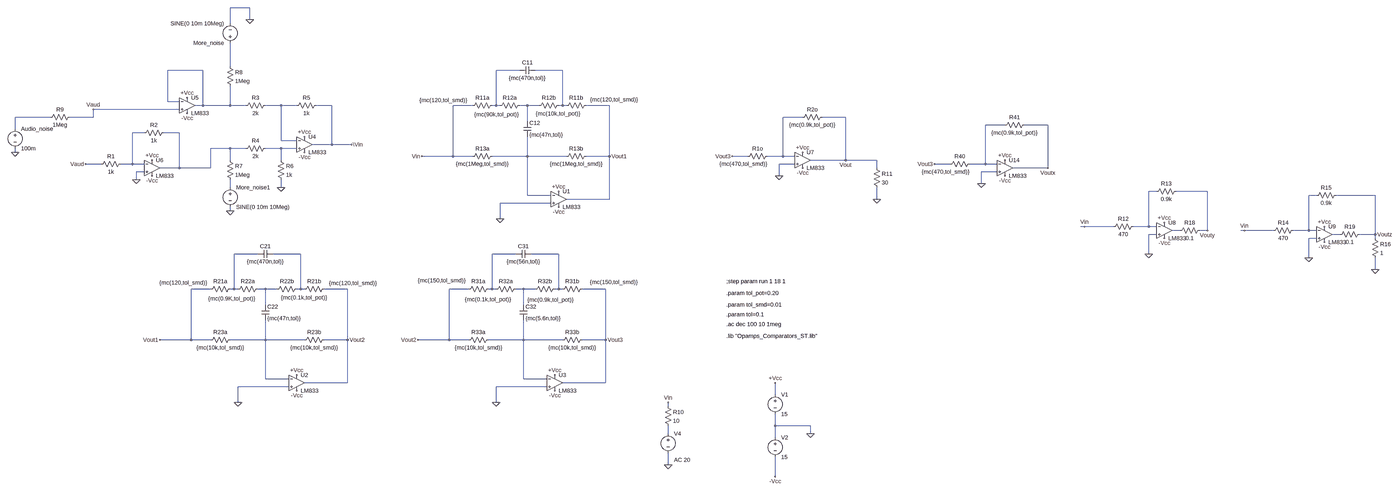
[diagram p0: schematic 3 band EQ.asc, whole sheet]
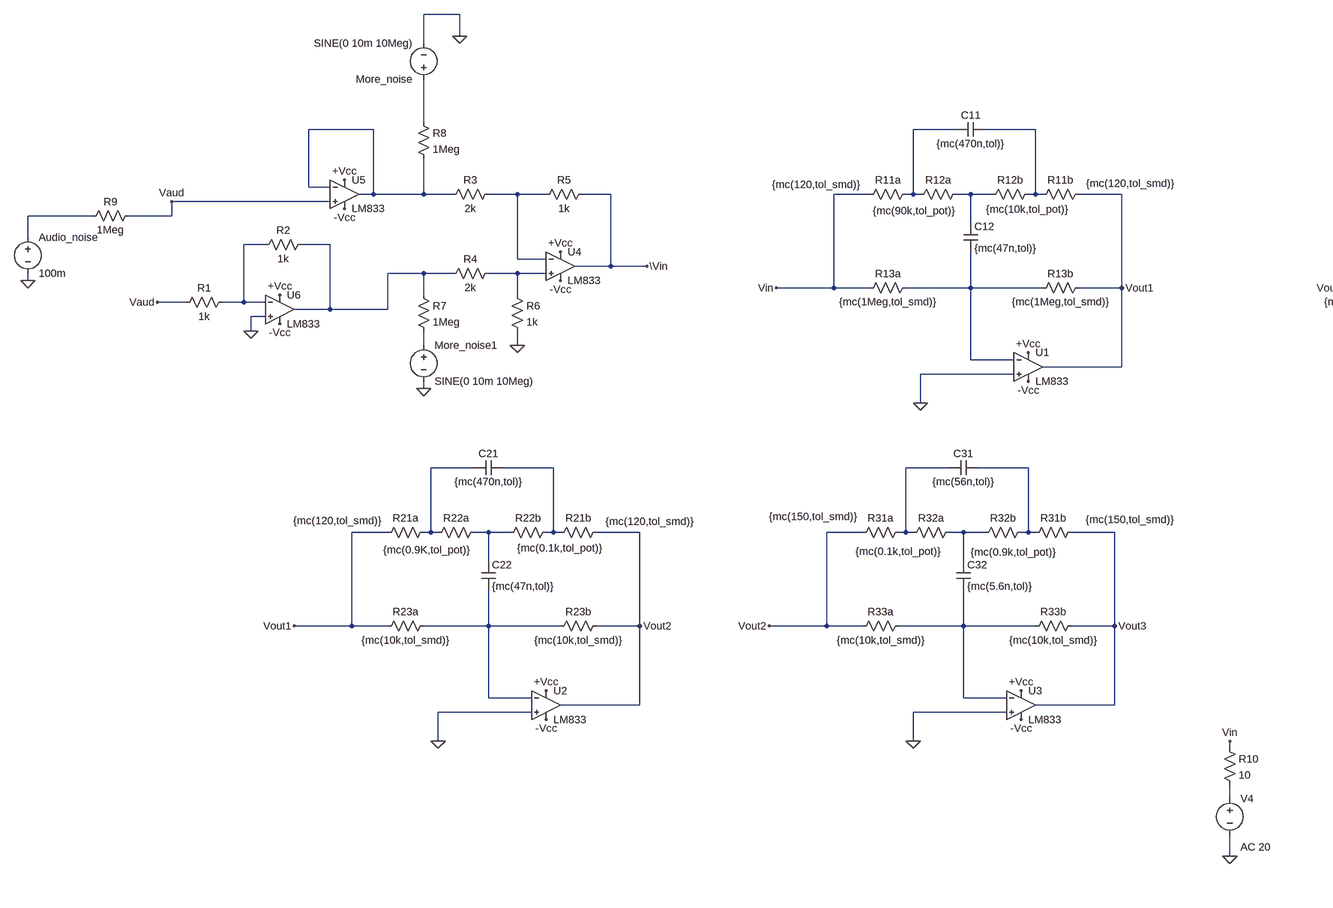
[diagram p1: schematic 3 band EQ.asc, part, row 1 of 1, column 1 of 2]
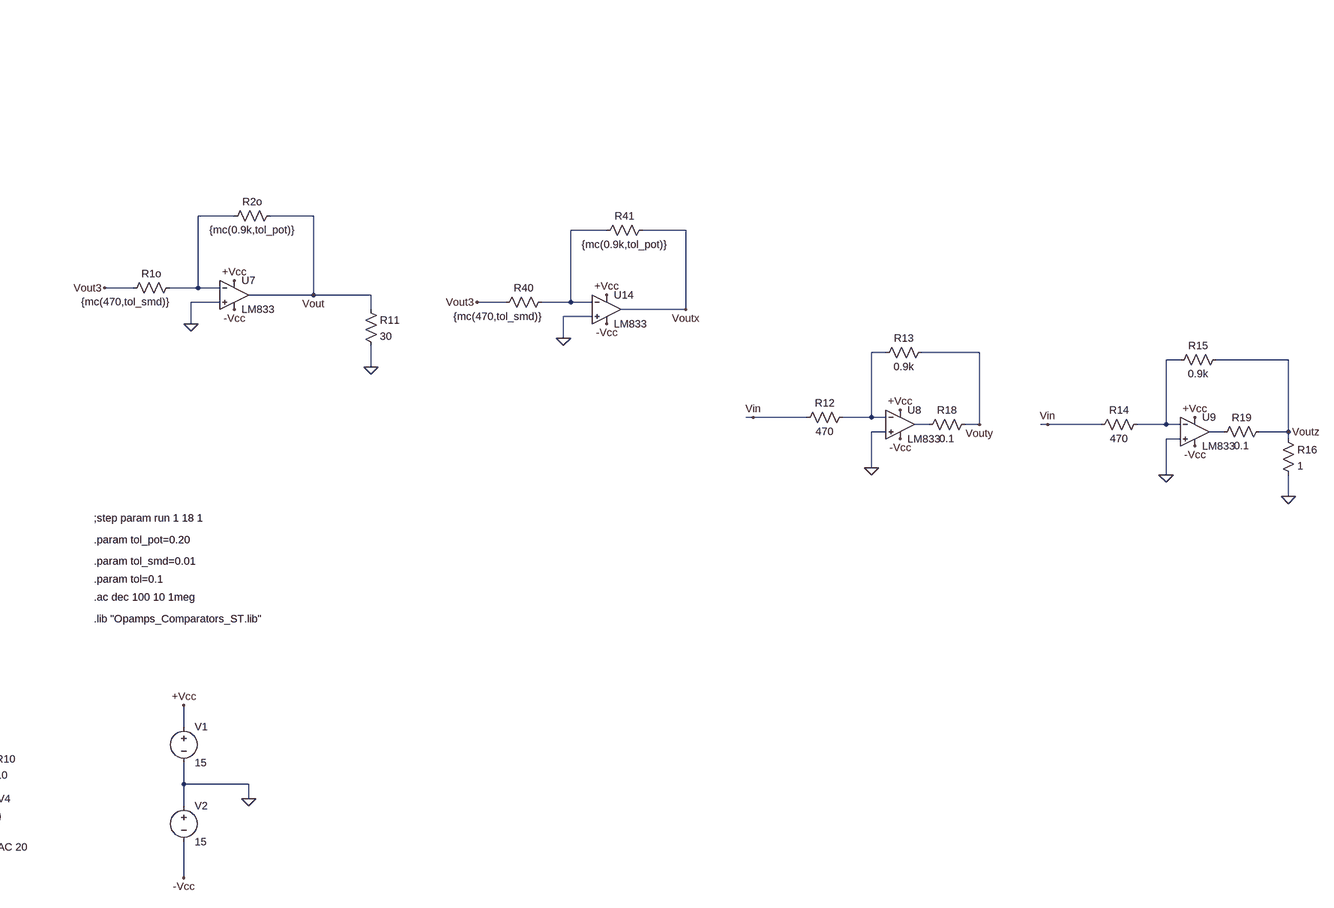
[diagram p2: schematic 3 band EQ.asc, part, row 1 of 1, column 2 of 2]
3 band EQ.asc, the LTspice schematic file:
Version 4
SHEET 1 6836 992
WIRE -400 -1072 -480 -1072
WIRE -400 -1024 -400 -1072
WIRE -480 -1008 -480 -1072
WIRE -480 -832 -480 -928
WIRE -592 -816 -736 -816
WIRE 704 -816 608 -816
WIRE 880 -816 768 -816
WIRE -736 -688 -736 -816
WIRE -688 -688 -736 -688
WIRE -592 -672 -592 -816
WIRE -592 -672 -624 -672
WIRE -480 -672 -480 -752
WIRE -480 -672 -592 -672
WIRE -416 -672 -480 -672
WIRE -272 -672 -336 -672
WIRE -208 -672 -272 -672
WIRE -64 -672 -128 -672
WIRE 512 -672 432 -672
WIRE 608 -672 608 -816
WIRE 608 -672 592 -672
WIRE 624 -672 608 -672
WIRE 736 -672 704 -672
WIRE 784 -672 736 -672
WIRE 880 -672 880 -816
WIRE 880 -672 864 -672
WIRE 896 -672 880 -672
WIRE 1072 -672 976 -672
WIRE -688 -656 -1040 -656
WIRE -1216 -624 -1360 -624
WIRE -1040 -624 -1040 -656
WIRE -1040 -624 -1136 -624
WIRE 1872 -624 1792 -624
WIRE 2048 -624 1952 -624
WIRE 736 -608 736 -672
WIRE 2848 -592 2768 -592
WIRE 3024 -592 2928 -592
WIRE -1360 -576 -1360 -624
WIRE -832 -560 -880 -560
WIRE -688 -560 -752 -560
WIRE -272 -528 -272 -672
WIRE -208 -528 -272 -528
WIRE -64 -512 -64 -672
WIRE -64 -512 -144 -512
WIRE 16 -512 -64 -512
WIRE -480 -496 -560 -496
WIRE -416 -496 -480 -496
WIRE -272 -496 -336 -496
WIRE -208 -496 -272 -496
WIRE -1360 -480 -1360 -496
WIRE 432 -464 432 -672
WIRE 432 -464 304 -464
WIRE 512 -464 432 -464
WIRE 736 -464 736 -544
WIRE 736 -464 592 -464
WIRE 896 -464 736 -464
WIRE 1072 -464 1072 -672
WIRE 1072 -464 976 -464
WIRE 1648 -464 1584 -464
WIRE 1792 -464 1792 -624
WIRE 1792 -464 1728 -464
WIRE 1840 -464 1792 -464
WIRE -480 -448 -480 -496
WIRE -272 -448 -272 -496
WIRE 2048 -448 2048 -624
WIRE 2048 -448 1904 -448
WIRE 2176 -448 2048 -448
WIRE -1008 -432 -1072 -432
WIRE -880 -432 -880 -560
WIRE -880 -432 -928 -432
WIRE -832 -432 -880 -432
WIRE 1840 -432 1776 -432
WIRE 2624 -432 2560 -432
WIRE 2768 -432 2768 -592
WIRE 2768 -432 2704 -432
WIRE 2816 -432 2768 -432
WIRE -688 -416 -688 -560
WIRE -688 -416 -768 -416
WIRE -560 -416 -560 -496
WIRE -560 -416 -688 -416
WIRE 2176 -416 2176 -448
WIRE 3024 -416 3024 -592
WIRE 3024 -416 2880 -416
WIRE -832 -400 -864 -400
WIRE 2816 -400 2752 -400
WIRE 1776 -384 1776 -432
WIRE -864 -368 -864 -400
WIRE 2752 -352 2752 -400
WIRE -480 -336 -480 -368
WIRE -272 -336 -272 -368
WIRE 3552 -320 3520 -320
WIRE 3760 -320 3632 -320
WIRE 736 -304 736 -464
WIRE 832 -304 736 -304
WIRE 4240 -304 4208 -304
WIRE 4480 -304 4320 -304
WIRE 1072 -288 1072 -464
WIRE 1072 -288 896 -288
WIRE 2176 -288 2176 -336
WIRE 832 -272 624 -272
WIRE -480 -240 -480 -256
WIRE 624 -208 624 -272
WIRE 3232 -176 3216 -176
WIRE 3376 -176 3232 -176
WIRE 3520 -176 3520 -320
WIRE 3520 -176 3456 -176
WIRE 3552 -176 3520 -176
WIRE 3648 -160 3616 -160
WIRE 3760 -160 3760 -320
WIRE 3760 -160 3728 -160
WIRE 3920 -160 3904 -160
WIRE 4064 -160 3920 -160
WIRE 4208 -160 4208 -304
WIRE 4208 -160 4144 -160
WIRE 4240 -160 4208 -160
WIRE 3552 -144 3520 -144
WIRE 4336 -144 4304 -144
WIRE 4480 -144 4480 -304
WIRE 4480 -144 4416 -144
WIRE 4240 -128 4208 -128
WIRE 4480 -128 4480 -144
WIRE -368 -64 -464 -64
WIRE -192 -64 -304 -64
WIRE 688 -64 592 -64
WIRE 864 -64 752 -64
WIRE 3520 -64 3520 -144
WIRE 4208 -48 4208 -128
WIRE 4480 0 4480 -48
WIRE -560 80 -640 80
WIRE -464 80 -464 -64
WIRE -464 80 -480 80
WIRE -448 80 -464 80
WIRE -336 80 -368 80
WIRE -288 80 -336 80
WIRE -192 80 -192 -64
WIRE -192 80 -208 80
WIRE -176 80 -192 80
WIRE 0 80 -96 80
WIRE 496 80 416 80
WIRE 592 80 592 -64
WIRE 592 80 576 80
WIRE 608 80 592 80
WIRE 720 80 688 80
WIRE 768 80 720 80
WIRE 864 80 864 -64
WIRE 864 80 848 80
WIRE 880 80 864 80
WIRE 1056 80 960 80
WIRE -336 144 -336 80
WIRE 720 144 720 80
WIRE -640 288 -640 80
WIRE -640 288 -768 288
WIRE -560 288 -640 288
WIRE -336 288 -336 208
WIRE -336 288 -480 288
WIRE -176 288 -336 288
WIRE 0 288 0 80
WIRE 0 288 -96 288
WIRE 416 288 416 80
WIRE 416 288 288 288
WIRE 496 288 416 288
WIRE 720 288 720 208
WIRE 720 288 576 288
WIRE 880 288 720 288
WIRE 1056 288 1056 80
WIRE 1056 288 960 288
WIRE -336 448 -336 288
WIRE -240 448 -336 448
WIRE 720 448 720 288
WIRE 816 448 720 448
WIRE 0 464 0 288
WIRE 0 464 -176 464
WIRE 1056 464 1056 288
WIRE 1056 464 880 464
WIRE -240 480 -448 480
WIRE 816 480 608 480
WIRE 1760 512 1760 464
WIRE -448 544 -448 480
WIRE 608 544 608 480
WIRE 1312 560 1312 544
WIRE 1760 640 1760 592
WIRE 1904 640 1760 640
WIRE 1312 672 1312 640
WIRE 1904 672 1904 640
WIRE 1760 688 1760 640
WIRE 1312 800 1312 752
WIRE 1760 848 1760 768
FLAG 1904 672 0
FLAG 1760 464 +Vcc
FLAG 1760 848 -Vcc
FLAG -448 544 0
FLAG 0 288 Vout2
FLAG -768 288 Vout1
FLAG -208 496 -Vcc
FLAG -208 432 +Vcc
FLAG 1312 800 0
FLAG 608 544 0
FLAG 1056 288 Vout3
FLAG 288 288 Vout2
FLAG 848 496 -Vcc
FLAG 848 432 +Vcc
FLAG 624 -208 0
FLAG 1072 -464 Vout1
FLAG 304 -464 Vin
FLAG 864 -256 -Vcc
FLAG 864 -320 +Vcc
FLAG 1312 544 Vin
FLAG -176 -544 +Vcc
FLAG -176 -480 -Vcc
FLAG -800 -384 -Vcc
FLAG -800 -448 +Vcc
FLAG -656 -640 -Vcc
FLAG -656 -704 +Vcc
FLAG -864 -368 0
FLAG -272 -336 0
FLAG -1040 -656 Vaud
FLAG -1072 -432 Vaud
FLAG 16 -512 \Vin
FLAG -1360 -480 0
FLAG -400 -1024 0
FLAG -480 -240 0
FLAG 1872 -416 -Vcc
FLAG 1872 -480 +Vcc
FLAG 1776 -384 0
FLAG 1584 -464 Vout3
FLAG 2048 -448 Vout
FLAG 2176 -288 0
FLAG 2848 -384 -Vcc
FLAG 2848 -448 +Vcc
FLAG 2752 -352 0
FLAG 2560 -432 Vout3
FLAG 3024 -416 Voutx
FLAG 3520 -64 0
FLAG 3232 -176 Vin
FLAG 3760 -160 Vouty
FLAG 4208 -48 0
FLAG 3920 -160 Vin
FLAG 4480 -144 Voutz
FLAG 4480 0 0
FLAG 3584 -128 -Vcc
FLAG 4272 -112 -Vcc
FLAG 3584 -192 +Vcc
FLAG 4272 -176 +Vcc
SYMBOL voltage 1760 496 R0
SYMATTR InstName V1
SYMATTR Value 15
SYMBOL voltage 1760 672 R0
SYMATTR InstName V2
SYMATTR Value 15
SYMBOL res -464 272 R90
WINDOW 0 0 56 VBottom 2
WINDOW 3 32 56 VTop 2
SYMATTR InstName R23a
SYMATTR Value {mc(10k,tol_smd)}
SYMBOL res -80 272 R90
WINDOW 0 0 56 VBottom 2
WINDOW 3 32 56 VTop 2
SYMATTR InstName R23b
SYMATTR Value {mc(10k,tol_smd)}
SYMBOL res -464 64 R90
WINDOW 0 0 56 VBottom 2
WINDOW 3 -26 207 VTop 2
SYMATTR InstName R21a
SYMATTR Value {mc(120,tol_smd)}
SYMBOL res -80 64 R90
WINDOW 0 0 56 VBottom 2
WINDOW 3 -24 -103 VTop 2
SYMATTR InstName R21b
SYMATTR Value {mc(120,tol_smd)}
SYMBOL res -192 64 R90
WINDOW 0 0 56 VBottom 2
WINDOW 3 35 -15 VTop 2
SYMATTR InstName R22b
SYMATTR Value {mc(0.1k,tol_pot)}
SYMBOL res -352 64 R90
WINDOW 0 0 56 VBottom 2
WINDOW 3 39 121 VTop 2
SYMATTR InstName R22a
SYMATTR Value {mc(0.9K,tol_pot)}
SYMBOL cap -352 144 R0
SYMATTR InstName C22
SYMATTR Value {mc(47n,tol)}
SYMBOL cap -304 -80 R90
WINDOW 0 0 32 VBottom 2
WINDOW 3 32 32 VTop 2
SYMATTR InstName C21
SYMATTR Value {mc(470n,tol)}
SYMBOL res 592 272 R90
WINDOW 0 0 56 VBottom 2
WINDOW 3 32 56 VTop 2
SYMATTR InstName R33a
SYMATTR Value {mc(10k,tol_smd)}
SYMBOL res 976 272 R90
WINDOW 0 0 56 VBottom 2
WINDOW 3 32 56 VTop 2
SYMATTR InstName R33b
SYMATTR Value {mc(10k,tol_smd)}
SYMBOL res 592 64 R90
WINDOW 0 0 56 VBottom 2
WINDOW 3 -35 206 VTop 2
SYMATTR InstName R31a
SYMATTR Value {mc(150,tol_smd)}
SYMBOL res 976 64 R90
WINDOW 0 0 56 VBottom 2
WINDOW 3 -28 -114 VTop 2
SYMATTR InstName R31b
SYMATTR Value {mc(150,tol_smd)}
SYMBOL res 864 64 R90
WINDOW 0 0 56 VBottom 2
WINDOW 3 44 33 VTop 2
SYMATTR InstName R32b
SYMATTR Value {mc(0.9k,tol_pot)}
SYMBOL res 704 64 R90
WINDOW 0 0 56 VBottom 2
WINDOW 3 43 129 VTop 2
SYMATTR InstName R32a
SYMATTR Value {mc(0.1k,tol_pot)}
SYMBOL cap 704 144 R0
SYMATTR InstName C32
SYMATTR Value {mc(5.6n,tol)}
SYMBOL cap 752 -80 R90
WINDOW 0 0 32 VBottom 2
WINDOW 3 32 32 VTop 2
SYMATTR InstName C31
SYMATTR Value {mc(56n,tol)}
SYMBOL voltage 1312 656 R0
WINDOW 123 24 124 Left 2
WINDOW 39 0 0 Left 0
SYMATTR Value2 AC 20
SYMATTR InstName V4
SYMATTR Value ""
SYMBOL res 608 -480 R90
WINDOW 0 0 56 VBottom 2
WINDOW 3 32 56 VTop 2
SYMATTR InstName R13a
SYMATTR Value {mc(1Meg,tol_smd)}
SYMBOL res 992 -480 R90
WINDOW 0 0 56 VBottom 2
WINDOW 3 32 56 VTop 2
SYMATTR InstName R13b
SYMATTR Value {mc(1Meg,tol_smd)}
SYMBOL res 608 -688 R90
WINDOW 0 0 56 VBottom 2
WINDOW 3 -21 215 VTop 2
SYMATTR InstName R11a
SYMATTR Value {mc(120,tol_smd)}
SYMBOL res 992 -688 R90
WINDOW 0 0 56 VBottom 2
WINDOW 3 -24 -99 VTop 2
SYMATTR InstName R11b
SYMATTR Value {mc(120,tol_smd)}
SYMBOL res 880 -688 R90
WINDOW 0 0 56 VBottom 2
WINDOW 3 34 18 VTop 2
SYMATTR InstName R12b
SYMATTR Value {mc(10k,tol_pot)}
SYMBOL res 720 -688 R90
WINDOW 0 0 56 VBottom 2
WINDOW 3 37 110 VTop 2
SYMATTR InstName R12a
SYMATTR Value {mc(90k,tol_pot)}
SYMBOL cap 720 -608 R0
SYMATTR InstName C12
SYMATTR Value {mc(47n,tol)}
SYMBOL cap 768 -832 R90
WINDOW 0 0 32 VBottom 2
WINDOW 3 32 32 VTop 2
SYMATTR InstName C11
SYMATTR Value {mc(470n,tol)}
SYMBOL Opamps\\opamp2 -208 400 R0
SYMATTR InstName U2
SYMATTR Value LM833
SYMBOL Opamps\\opamp2 864 -352 R0
SYMATTR InstName U1
SYMATTR Value LM833
SYMBOL Opamps\\opamp2 848 400 R0
SYMATTR InstName U3
SYMATTR Value LM833
SYMBOL Opamps\\opamp2 -176 -576 R0
SYMATTR InstName U4
SYMATTR Value LM833
SYMBOL Opamps\\opamp2 -656 -736 R0
SYMATTR InstName U5
SYMATTR Value LM833
SYMBOL Opamps\\opamp2 -800 -480 R0
SYMATTR InstName U6
SYMATTR Value LM833
SYMBOL res -912 -448 R90
WINDOW 0 0 56 VBottom 2
WINDOW 3 32 56 VTop 2
SYMATTR InstName R1
SYMATTR Value 1k
SYMBOL res -736 -576 R90
WINDOW 0 0 56 VBottom 2
WINDOW 3 32 56 VTop 2
SYMATTR InstName R2
SYMATTR Value 1k
SYMBOL res -320 -688 R90
WINDOW 0 0 56 VBottom 2
WINDOW 3 32 56 VTop 2
SYMATTR InstName R3
SYMATTR Value 2k
SYMBOL res -320 -512 R90
WINDOW 0 0 56 VBottom 2
WINDOW 3 32 56 VTop 2
SYMATTR InstName R4
SYMATTR Value 2k
SYMBOL res -112 -688 R90
WINDOW 0 0 56 VBottom 2
WINDOW 3 32 56 VTop 2
SYMATTR InstName R5
SYMATTR Value 1k
SYMBOL res -288 -464 R0
SYMATTR InstName R6
SYMATTR Value 1k
SYMBOL voltage -1360 -592 R0
SYMATTR InstName Audio_noise
SYMATTR Value 100m
SYMBOL voltage -480 -352 R0
WINDOW 123 0 0 Left 0
WINDOW 39 0 0 Left 0
SYMATTR InstName More_noise1
SYMATTR Value SINE(0 10m 10Meg)
SYMBOL voltage -480 -912 R180
WINDOW 123 0 0 Left 0
WINDOW 39 0 0 Left 0
SYMATTR InstName More_noise
SYMATTR Value SINE(0 10m 10Meg)
SYMBOL res -496 -464 R0
SYMATTR InstName R7
SYMATTR Value 1Meg
SYMBOL res -496 -848 R0
SYMATTR InstName R8
SYMATTR Value 1Meg
SYMBOL res -1120 -640 R90
WINDOW 0 0 56 VBottom 2
WINDOW 3 32 56 VTop 2
SYMATTR InstName R9
SYMATTR Value 1Meg
SYMBOL res 1296 544 R0
SYMATTR InstName R10
SYMATTR Value 10
SYMBOL Opamps\\opamp2 1872 -512 R0
SYMATTR InstName U7
SYMATTR Value LM833
SYMBOL res 1744 -480 R90
WINDOW 0 0 56 VBottom 2
WINDOW 3 32 114 VTop 2
SYMATTR InstName R1o
SYMATTR Value {mc(470,tol_smd)}
SYMBOL res 1968 -640 R90
WINDOW 0 0 56 VBottom 2
WINDOW 3 32 56 VTop 2
SYMATTR InstName R2o
SYMATTR Value {mc(0.9k,tol_pot)}
SYMBOL res 2160 -432 R0
SYMATTR InstName R11
SYMATTR Value 30
SYMBOL Opamps\\opamp2 2848 -480 R0
SYMATTR InstName U14
SYMATTR Value LM833
SYMBOL res 2720 -448 R90
WINDOW 0 0 56 VBottom 2
WINDOW 3 32 114 VTop 2
SYMATTR InstName R40
SYMATTR Value {mc(470,tol_smd)}
SYMBOL res 2944 -608 R90
WINDOW 0 0 56 VBottom 2
WINDOW 3 32 56 VTop 2
SYMATTR InstName R41
SYMATTR Value {mc(0.9k,tol_pot)}
SYMBOL Opamps\\opamp2 3584 -224 R0
SYMATTR InstName U8
SYMATTR Value LM833
SYMBOL res 3472 -192 R90
WINDOW 0 0 56 VBottom 2
WINDOW 3 32 56 VTop 2
SYMATTR InstName R12
SYMATTR Value 470
SYMBOL res 3648 -336 R90
WINDOW 0 0 56 VBottom 2
WINDOW 3 32 56 VTop 2
SYMATTR InstName R13
SYMATTR Value 0.9k
SYMBOL Opamps\\opamp2 4272 -208 R0
SYMATTR InstName U9
SYMATTR Value LM833
SYMBOL res 4160 -176 R90
WINDOW 0 0 56 VBottom 2
WINDOW 3 32 56 VTop 2
SYMATTR InstName R14
SYMATTR Value 470
SYMBOL res 4336 -320 R90
WINDOW 0 0 56 VBottom 2
WINDOW 3 32 56 VTop 2
SYMATTR InstName R15
SYMATTR Value 0.9k
SYMBOL res 4464 -144 R0
SYMATTR InstName R16
SYMATTR Value 1
SYMBOL res 3744 -176 R90
WINDOW 0 0 56 VBottom 2
WINDOW 3 32 56 VTop 2
SYMATTR InstName R18
SYMATTR Value 0.1
SYMBOL res 4432 -160 R90
WINDOW 0 0 56 VBottom 2
WINDOW 3 32 56 VTop 2
SYMATTR InstName R19
SYMATTR Value 0.1
TEXT 1560 272 Left 2 !.lib "Opamps_Comparators_ST.lib"
TEXT 1560 224 Left 2 !.ac dec 100 10 1meg
TEXT 1560 184 Left 2 !.param tol=0.1
TEXT 1560 144 Left 2 !.param tol_smd=0.01
TEXT 1560 48 Left 2 !;step param run 1 18 1
TEXT 1560 96 Left 2 !.param tol_pot=0.20

The netlist it stands for:
* 3 band EQ.asc
V1 +Vcc 0 15
V2 0 -Vcc 15
R23a N025 Vout1 {mc(10k,tol_smd)}
R23b Vout2 N025 {mc(10k,tol_smd)}
R21a N019 Vout1 {mc(120,tol_smd)}
R21b Vout2 N020 {mc(120,tol_smd)}
R22b N020 N023 {mc(0.1k,tol_pot)}
R22a N023 N019 {mc(0.9K,tol_pot)}
C22 N023 N025 {mc(47n,tol)}
C21 N020 N019 {mc(470n,tol)}
R33a N026 Vout2 {mc(10k,tol_smd)}
R33b Vout3 N026 {mc(10k,tol_smd)}
R31a N021 Vout2 {mc(150,tol_smd)}
R31b Vout3 N022 {mc(150,tol_smd)}
R32b N022 N024 {mc(0.9k,tol_pot)}
R32a N024 N021 {mc(0.1k,tol_pot)}
C32 N024 N026 {mc(5.6n,tol)}
C31 N022 N021 {mc(56n,tol)}
V4 N027 0 AC 20
R13a N013 Vin {mc(1Meg,tol_smd)}
R13b Vout1 N013 {mc(1Meg,tol_smd)}
R11a N003 Vin {mc(120,tol_smd)}
R11b Vout1 N004 {mc(120,tol_smd)}
R12b N004 N006 {mc(10k,tol_pot)}
R12a N006 N003 {mc(90k,tol_pot)}
C12 N006 N013 {mc(47n,tol)}
C11 N004 N003 {mc(470n,tol)}
XU2 0 N025 +Vcc -Vcc Vout2 LM833  ; pins In+ In- V+ V- OUT
XU1 0 N013 +Vcc -Vcc Vout1 LM833  ; pins In+ In- V+ V- OUT
XU3 0 N026 +Vcc -Vcc Vout3 LM833  ; pins In+ In- V+ V- OUT
XU4 N012 N005 +Vcc -Vcc \Vin LM833  ; pins In+ In- V+ V- OUT
XU5 Vaud N002 +Vcc -Vcc N002 LM833  ; pins In+ In- V+ V- OUT
XU6 0 N010 +Vcc -Vcc N011 LM833  ; pins In+ In- V+ V- OUT
R1 N010 Vaud 1k
R2 N011 N010 1k
R3 N005 N002 2k
R4 N012 N011 2k
R5 \Vin N005 1k
R6 N012 0 1k
V§Audio_noise N007 0 100m
V§More_noise1 N014 0 SINE(0 10m 10Meg)
V§More_noise N001 0 SINE(0 10m 10Meg)
R7 N011 N014 1Meg
R8 N001 N002 1Meg
R9 Vaud N007 1Meg
R10 Vin N027 10
XU7 0 N008 +Vcc -Vcc Vout LM833  ; pins In+ In- V+ V- OUT
R1o N008 Vout3 {mc(470,tol_smd)}
R2o Vout N008 {mc(0.9k,tol_pot)}
R11 Vout 0 30
XU14 0 N009 +Vcc -Vcc Voutx LM833  ; pins In+ In- V+ V- OUT
R40 N009 Vout3 {mc(470,tol_smd)}
R41 Voutx N009 {mc(0.9k,tol_pot)}
XU8 0 N015 +Vcc -Vcc N017 LM833  ; pins In+ In- V+ V- OUT
R12 N015 Vin 470
R13 Vouty N015 0.9k
XU9 0 N016 +Vcc -Vcc N018 LM833  ; pins In+ In- V+ V- OUT
R14 N016 Vin 470
R15 Voutz N016 0.9k
R16 Voutz 0 1
R18 Vouty N017 0.1
R19 Voutz N018 0.1
.lib "Opamps_Comparators_ST.lib"
.ac dec 100 10 1meg
.param tol=0.1
.param tol_smd=0.01
;step param run 1 18 1
.param tol_pot=0.20
.backanno
.end